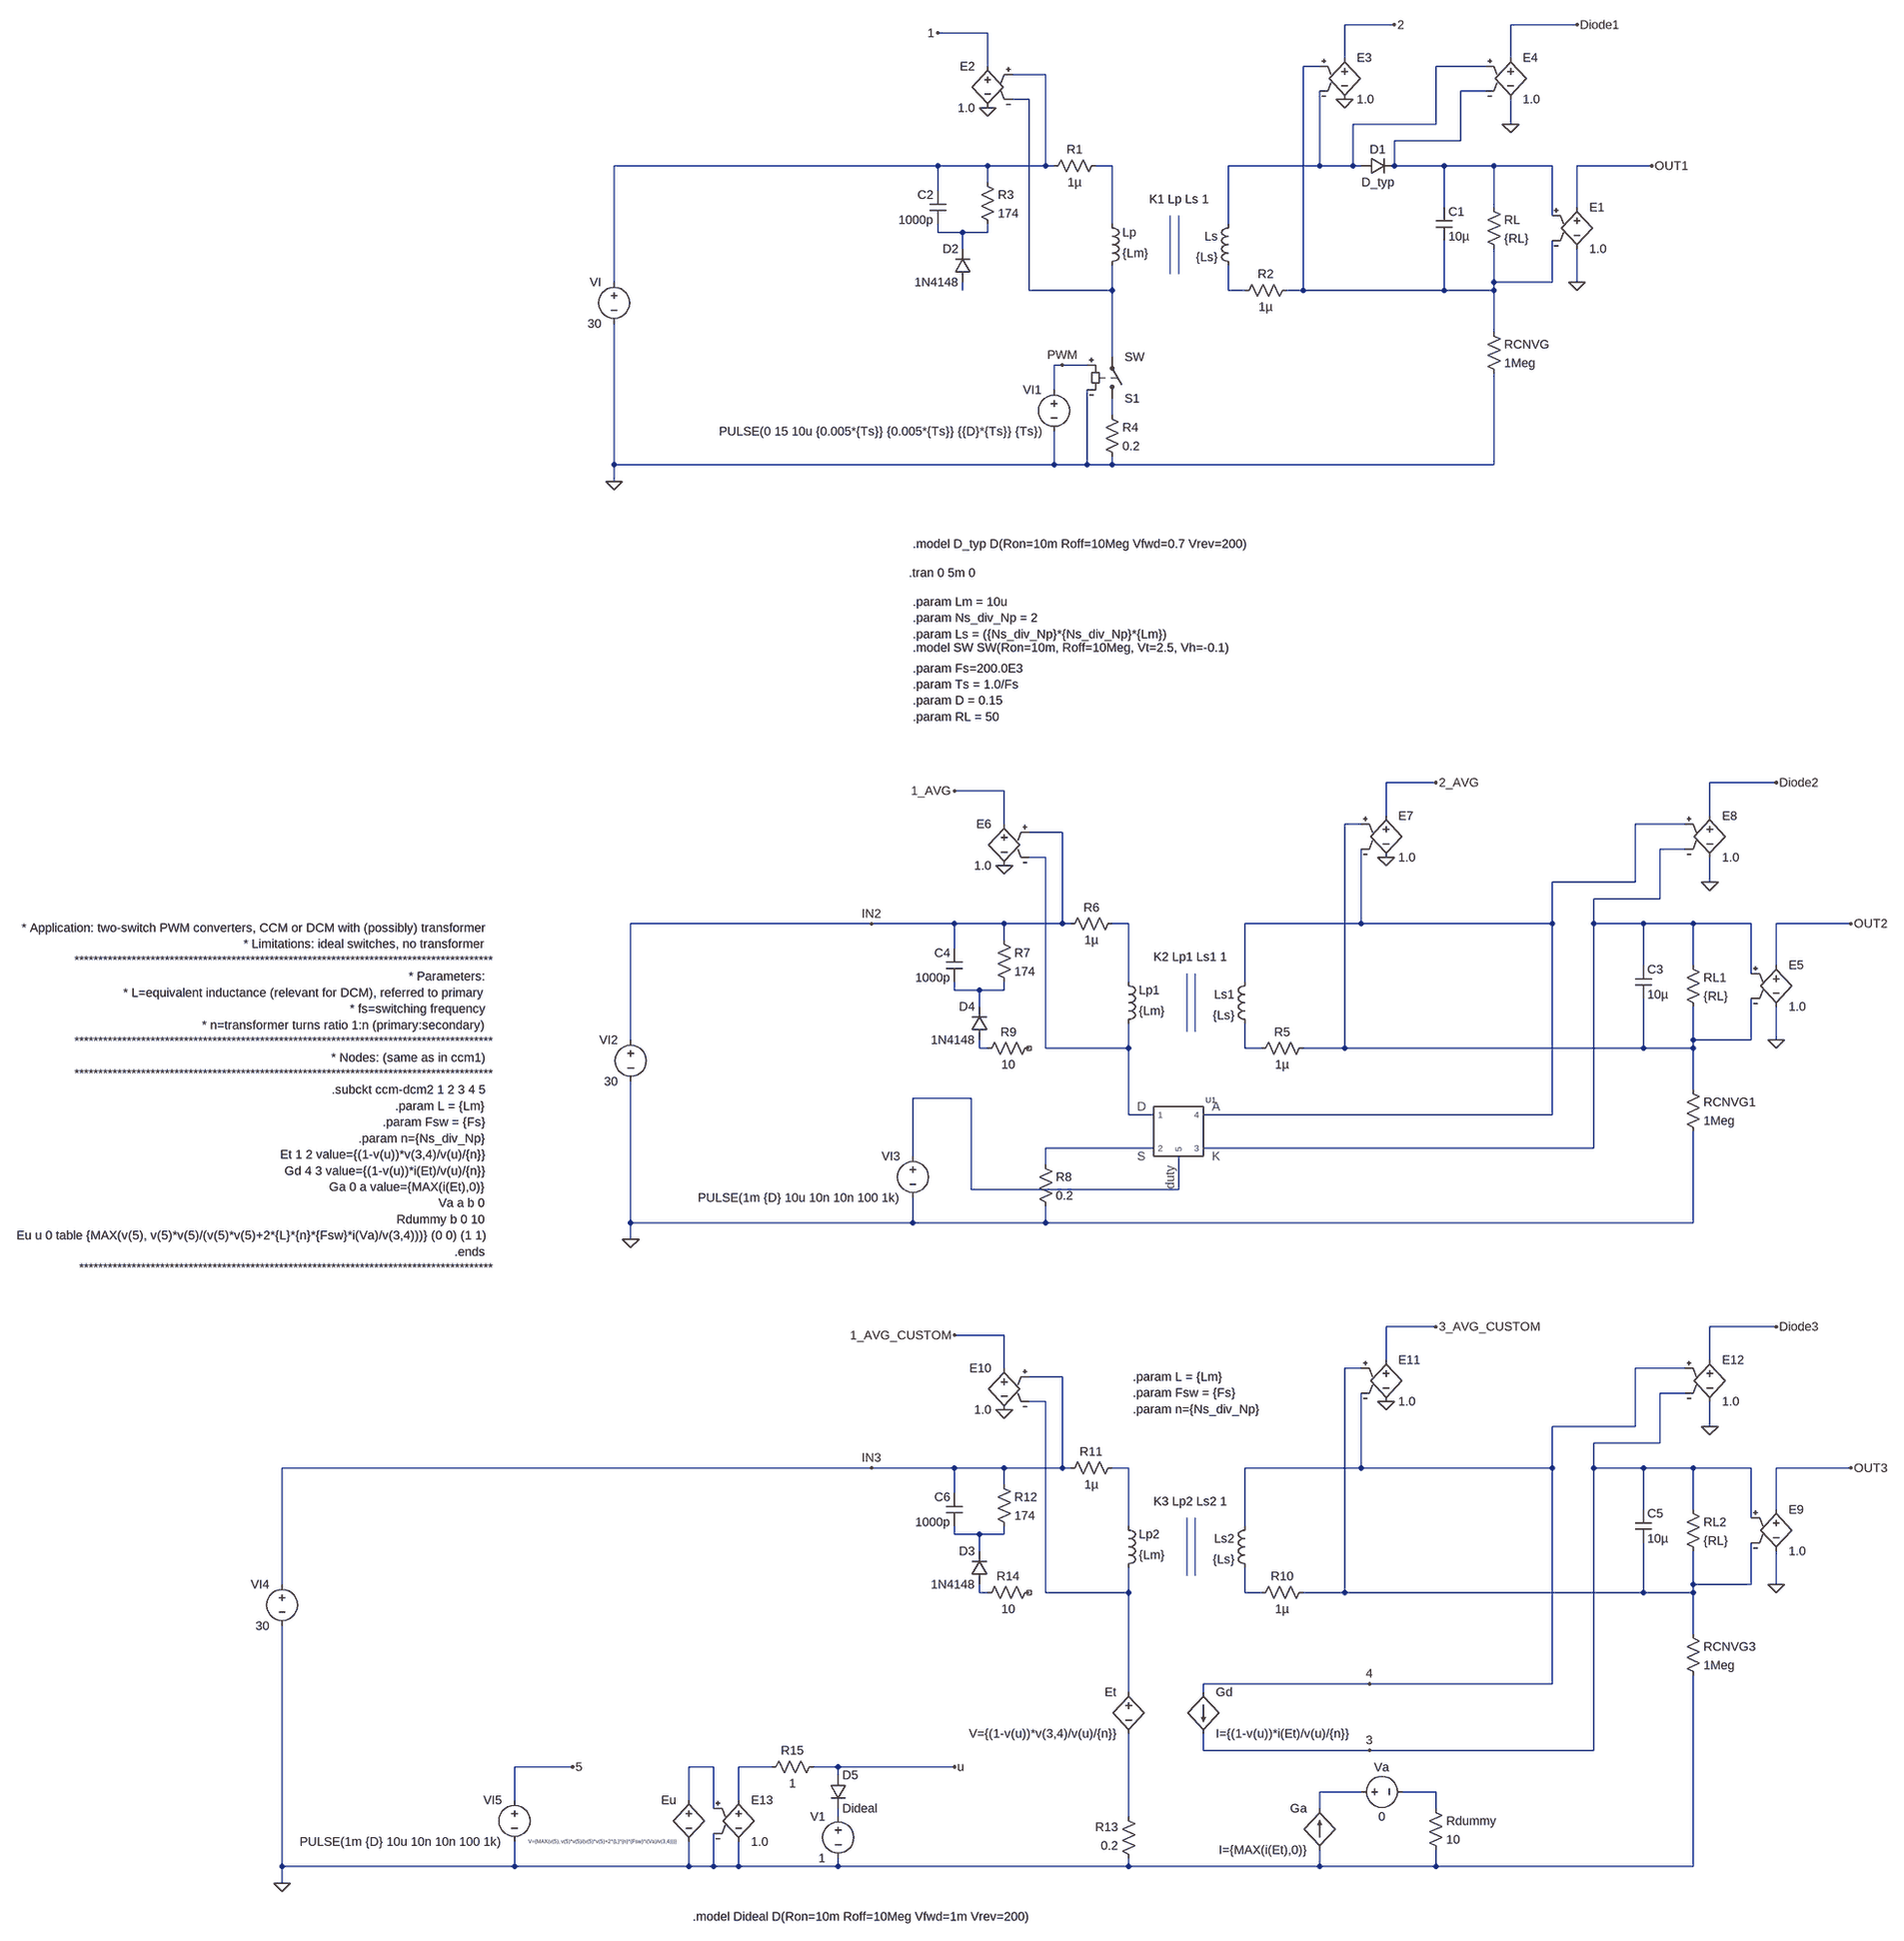
[diagram p0: schematic Flyback_Basic_Model.asc]
Flyback_Basic_Model.asc, the LTspice schematic file:
Version 4.1
SHEET 1 1712 3524
WIRE 624 -288 528 -288
WIRE 976 -288 848 -288
WIRE -160 -272 -256 -272
WIRE 528 -224 528 -288
WIRE 848 -224 848 -288
WIRE -160 -208 -160 -272
WIRE 480 -208 448 -208
WIRE 800 -208 704 -208
WIRE -48 -192 -112 -192
WIRE 800 -160 752 -160
WIRE -80 -144 -112 -144
WIRE 704 -96 704 -208
WIRE 704 -96 544 -96
WIRE 848 -96 848 -144
WIRE 752 -64 752 -160
WIRE 752 -64 624 -64
WIRE -256 -16 -880 -16
WIRE -160 -16 -256 -16
WIRE -48 -16 -48 -192
WIRE -48 -16 -160 -16
WIRE -32 -16 -48 -16
WIRE 80 -16 48 -16
WIRE 480 -16 480 -160
WIRE 480 -16 304 -16
WIRE 544 -16 544 -96
WIRE 544 -16 480 -16
WIRE 560 -16 544 -16
WIRE 624 -16 624 -64
WIRE 720 -16 624 -16
WIRE 816 -16 720 -16
WIRE 928 -16 816 -16
WIRE 1120 -16 976 -16
WIRE -160 16 -160 -16
WIRE -256 32 -256 -16
WIRE 720 64 720 -16
WIRE 816 64 816 -16
WIRE 976 64 976 -16
WIRE 928 80 928 -16
WIRE 80 96 80 -16
WIRE 304 96 304 -16
WIRE -256 112 -256 96
WIRE -208 112 -256 112
WIRE -160 112 -160 96
WIRE -160 112 -208 112
WIRE -208 144 -208 112
WIRE -880 208 -880 -16
WIRE 816 208 816 144
WIRE 928 208 928 128
WIRE 928 208 816 208
WIRE 976 208 976 144
WIRE -208 224 -208 208
WIRE -80 224 -80 -144
WIRE 80 224 80 176
WIRE 80 224 -80 224
WIRE 304 224 304 176
WIRE 336 224 304 224
WIRE 448 224 448 -208
WIRE 448 224 416 224
WIRE 720 224 720 128
WIRE 720 224 448 224
WIRE 816 224 816 208
WIRE 816 224 720 224
WIRE 816 304 816 224
WIRE 80 352 80 224
WIRE -16 368 -32 368
WIRE 32 368 -16 368
WIRE -32 416 -32 368
WIRE 80 464 80 432
WIRE -880 560 -880 288
WIRE -32 560 -32 496
WIRE -32 560 -880 560
WIRE 32 560 32 416
WIRE 32 560 -32 560
WIRE 80 560 80 544
WIRE 80 560 32 560
WIRE 816 560 816 384
WIRE 816 560 80 560
WIRE -880 592 -880 560
WIRE 704 1184 608 1184
WIRE 1360 1184 1232 1184
WIRE -128 1200 -224 1200
WIRE 608 1248 608 1184
WIRE 1232 1248 1232 1184
WIRE -128 1264 -128 1200
WIRE 560 1264 528 1264
WIRE 1184 1264 1088 1264
WIRE -16 1280 -80 1280
WIRE 1184 1312 1136 1312
WIRE -48 1328 -80 1328
WIRE 1088 1376 1088 1264
WIRE 1088 1376 928 1376
WIRE 1232 1376 1232 1328
WIRE 1136 1408 1136 1312
WIRE 1136 1408 1008 1408
WIRE -384 1456 -848 1456
WIRE -224 1456 -384 1456
WIRE -128 1456 -224 1456
WIRE -16 1456 -16 1280
WIRE -16 1456 -128 1456
WIRE 0 1456 -16 1456
WIRE 112 1456 80 1456
WIRE 560 1456 560 1312
WIRE 560 1456 336 1456
WIRE 928 1456 928 1376
WIRE 928 1456 560 1456
WIRE 1008 1456 1008 1408
WIRE 1104 1456 1008 1456
WIRE 1200 1456 1104 1456
WIRE 1312 1456 1200 1456
WIRE 1504 1456 1360 1456
WIRE -128 1488 -128 1456
WIRE -224 1504 -224 1456
WIRE 1104 1536 1104 1456
WIRE 1200 1536 1200 1456
WIRE 1360 1536 1360 1456
WIRE 1312 1552 1312 1456
WIRE 112 1568 112 1456
WIRE 336 1568 336 1456
WIRE -224 1584 -224 1568
WIRE -176 1584 -224 1584
WIRE -128 1584 -128 1568
WIRE -128 1584 -176 1584
WIRE -176 1616 -176 1584
WIRE -848 1680 -848 1456
WIRE 1200 1680 1200 1616
WIRE 1312 1680 1312 1600
WIRE 1312 1680 1200 1680
WIRE 1360 1680 1360 1616
WIRE -176 1696 -176 1680
WIRE -160 1696 -176 1696
WIRE -48 1696 -48 1328
WIRE 112 1696 112 1648
WIRE 112 1696 -48 1696
WIRE 336 1696 336 1648
WIRE 368 1696 336 1696
WIRE 528 1696 528 1264
WIRE 528 1696 448 1696
WIRE 1104 1696 1104 1600
WIRE 1104 1696 528 1696
WIRE 1200 1696 1200 1680
WIRE 1200 1696 1104 1696
WIRE 1200 1776 1200 1696
WIRE -192 1792 -304 1792
WIRE 112 1824 112 1696
WIRE 160 1824 112 1824
WIRE 928 1824 928 1456
WIRE 928 1824 256 1824
WIRE 160 1888 -48 1888
WIRE 1008 1888 1008 1456
WIRE 1008 1888 256 1888
WIRE -304 1904 -304 1792
WIRE -48 1920 -48 1888
WIRE -192 1968 -192 1792
WIRE 208 1968 208 1904
WIRE 208 1968 -192 1968
WIRE -848 2032 -848 1760
WIRE -304 2032 -304 1984
WIRE -304 2032 -848 2032
WIRE -48 2032 -48 2000
WIRE -48 2032 -304 2032
WIRE 1200 2032 1200 1856
WIRE 1200 2032 -48 2032
WIRE -848 2064 -848 2032
WIRE 704 2256 608 2256
WIRE 1360 2256 1232 2256
WIRE -128 2272 -224 2272
WIRE 608 2320 608 2256
WIRE 1232 2320 1232 2256
WIRE -128 2336 -128 2272
WIRE 560 2336 528 2336
WIRE 1184 2336 1088 2336
WIRE -16 2352 -80 2352
WIRE 1184 2384 1136 2384
WIRE -48 2400 -80 2400
WIRE 1088 2448 1088 2336
WIRE 1088 2448 928 2448
WIRE 1232 2448 1232 2400
WIRE 1136 2480 1136 2384
WIRE 1136 2480 1008 2480
WIRE -384 2528 -1520 2528
WIRE -224 2528 -384 2528
WIRE -128 2528 -224 2528
WIRE -16 2528 -16 2352
WIRE -16 2528 -128 2528
WIRE 0 2528 -16 2528
WIRE 112 2528 80 2528
WIRE 560 2528 560 2384
WIRE 560 2528 336 2528
WIRE 928 2528 928 2448
WIRE 928 2528 560 2528
WIRE 1008 2528 1008 2480
WIRE 1104 2528 1008 2528
WIRE 1200 2528 1104 2528
WIRE 1312 2528 1200 2528
WIRE 1504 2528 1360 2528
WIRE -128 2560 -128 2528
WIRE -224 2576 -224 2528
WIRE 1104 2608 1104 2528
WIRE 1200 2608 1200 2528
WIRE 1360 2608 1360 2528
WIRE 1312 2624 1312 2528
WIRE 112 2640 112 2528
WIRE 336 2640 336 2528
WIRE -224 2656 -224 2640
WIRE -176 2656 -224 2656
WIRE -128 2656 -128 2640
WIRE -128 2656 -176 2656
WIRE -176 2688 -176 2656
WIRE -1520 2752 -1520 2528
WIRE 1200 2752 1200 2688
WIRE 1312 2752 1312 2672
WIRE 1312 2752 1200 2752
WIRE 1360 2752 1360 2688
WIRE -176 2768 -176 2752
WIRE -160 2768 -176 2768
WIRE -48 2768 -48 2400
WIRE 112 2768 112 2720
WIRE 112 2768 -48 2768
WIRE 336 2768 336 2720
WIRE 368 2768 336 2768
WIRE 528 2768 528 2336
WIRE 528 2768 448 2768
WIRE 1104 2768 1104 2672
WIRE 1104 2768 528 2768
WIRE 1200 2768 1200 2752
WIRE 1200 2768 1104 2768
WIRE 1200 2848 1200 2768
WIRE 576 2944 256 2944
WIRE 928 2944 928 2528
WIRE 928 2944 576 2944
WIRE 112 2960 112 2768
WIRE 256 2960 256 2944
WIRE 256 3072 256 3040
WIRE 576 3072 256 3072
WIRE 1008 3072 1008 2528
WIRE 1008 3072 576 3072
WIRE -960 3104 -1072 3104
WIRE -688 3104 -736 3104
WIRE -576 3104 -640 3104
WIRE -448 3104 -496 3104
WIRE -224 3104 -448 3104
WIRE -448 3120 -448 3104
WIRE 560 3152 480 3152
WIRE 704 3152 640 3152
WIRE -1072 3168 -1072 3104
WIRE -736 3168 -736 3104
WIRE -640 3168 -640 3104
WIRE -688 3184 -688 3104
WIRE 480 3184 480 3152
WIRE 704 3184 704 3152
WIRE -448 3200 -448 3184
WIRE 112 3200 112 3040
WIRE -1520 3296 -1520 2832
WIRE -1072 3296 -1072 3248
WIRE -1072 3296 -1520 3296
WIRE -736 3296 -736 3248
WIRE -736 3296 -1072 3296
WIRE -688 3296 -688 3232
WIRE -688 3296 -736 3296
WIRE -640 3296 -640 3248
WIRE -640 3296 -688 3296
WIRE -448 3296 -448 3280
WIRE -448 3296 -640 3296
WIRE 112 3296 112 3280
WIRE 112 3296 -448 3296
WIRE 480 3296 480 3264
WIRE 480 3296 112 3296
WIRE 704 3296 704 3264
WIRE 704 3296 480 3296
WIRE 1200 3296 1200 2928
WIRE 1200 3296 704 3296
WIRE -1520 3328 -1520 3296
FLAG -880 592 0
FLAG 976 208 0
FLAG 1120 -16 OUT1
FLAG -160 -128 0
FLAG 528 -144 0
FLAG -256 -272 1
FLAG 624 -288 2
FLAG 848 -96 0
FLAG 976 -288 Diode1
FLAG -848 2064 0
FLAG 1360 1680 0
FLAG 1504 1456 OUT2
FLAG -128 1344 0
FLAG 608 1328 0
FLAG -224 1200 1_AVG
FLAG 704 1184 2_AVG
FLAG -384 1456 IN2
FLAG 1232 1376 0
FLAG 1360 1184 Diode2
FLAG -16 368 PWM
FLAG -1520 3328 0
FLAG 1360 2752 0
FLAG 1504 2528 OUT3
FLAG -128 2416 0
FLAG 608 2400 0
FLAG -224 2272 1_AVG_CUSTOM
FLAG 704 2256 3_AVG_CUSTOM
FLAG -384 2528 IN3
FLAG 1232 2448 0
FLAG 1360 2256 Diode3
FLAG -960 3104 5
FLAG -224 3104 u
FLAG 576 2944 4
FLAG 576 3072 3
SYMBOL ind 64 192 M180
WINDOW 0 36 80 Left 2
WINDOW 3 36 40 Left 2
SYMATTR InstName Lp
SYMATTR Value {Lm}
SYMATTR Type ind
SYMBOL ind 320 80 M0
SYMATTR InstName Ls
SYMATTR Value {Ls}
SYMATTR Type ind
SYMBOL voltage -880 192 M0
WINDOW 123 0 0 Left 0
WINDOW 39 0 0 Left 0
SYMATTR InstName VI
SYMATTR Value 30
SYMBOL voltage -32 400 M0
WINDOW 123 0 0 Left 0
WINDOW 39 0 0 Left 0
SYMATTR InstName VI1
SYMATTR Value PULSE(0 15 10u {0.005*{Ts}} {0.005*{Ts}} {{D}*{Ts}} {Ts})
SYMBOL res 800 48 R0
SYMATTR InstName RL
SYMATTR Value {RL}
SYMBOL cap 704 64 R0
SYMATTR InstName C1
SYMATTR Value 10µ
SYMBOL diode 560 0 R270
WINDOW 0 32 32 VTop 2
WINDOW 3 0 32 VBottom 2
SYMATTR InstName D1
SYMATTR Value D_typ
SYMBOL res 800 288 R0
SYMATTR InstName RCNVG
SYMATTR Value 1Meg
SYMBOL e 976 48 R0
SYMATTR InstName E1
SYMATTR Value 1.0
SYMBOL res 432 208 R90
WINDOW 0 0 56 VBottom 2
WINDOW 3 32 56 VTop 2
SYMATTR InstName R2
SYMATTR Value 1µ
SYMBOL res -48 0 R270
WINDOW 0 32 56 VTop 2
WINDOW 3 0 56 VBottom 2
SYMATTR InstName R1
SYMATTR Value 1µ
SYMBOL e -160 -224 M0
SYMATTR InstName E2
SYMATTR Value 1.0
SYMBOL e 528 -240 R0
SYMATTR InstName E3
SYMATTR Value 1.0
SYMBOL sw 80 448 M180
SYMATTR InstName S1
SYMBOL diode -192 208 R180
WINDOW 0 24 64 Left 2
WINDOW 3 24 0 Left 2
SYMATTR InstName D2
SYMATTR Value 1N4148
SYMBOL cap -240 32 M0
SYMATTR InstName C2
SYMATTR Value 1000p
SYMBOL res -176 0 R0
SYMATTR InstName R3
SYMATTR Value 174
SYMBOL res 64 448 R0
SYMATTR InstName R4
SYMATTR Value 0.2
SYMBOL e 848 -240 R0
SYMATTR InstName E4
SYMATTR Value 1.0
SYMBOL ind 96 1664 M180
WINDOW 0 36 80 Left 2
WINDOW 3 36 40 Left 2
SYMATTR InstName Lp1
SYMATTR Value {Lm}
SYMATTR Type ind
SYMBOL ind 352 1552 M0
SYMATTR InstName Ls1
SYMATTR Value {Ls}
SYMATTR Type ind
SYMBOL voltage -848 1664 M0
WINDOW 123 0 0 Left 0
WINDOW 39 0 0 Left 0
SYMATTR InstName VI2
SYMATTR Value 30
SYMBOL res 1184 1520 R0
SYMATTR InstName RL1
SYMATTR Value {RL}
SYMBOL cap 1088 1536 R0
SYMATTR InstName C3
SYMATTR Value 10µ
SYMBOL res 1184 1760 R0
SYMATTR InstName RCNVG1
SYMATTR Value 1Meg
SYMBOL e 1360 1520 R0
SYMATTR InstName E5
SYMATTR Value 1.0
SYMBOL res 464 1680 R90
WINDOW 0 0 56 VBottom 2
WINDOW 3 32 56 VTop 2
SYMATTR InstName R5
SYMATTR Value 1µ
SYMBOL res -16 1472 R270
WINDOW 0 32 56 VTop 2
WINDOW 3 0 56 VBottom 2
SYMATTR InstName R6
SYMATTR Value 1µ
SYMBOL e -128 1248 M0
SYMATTR InstName E6
SYMATTR Value 1.0
SYMBOL e 608 1232 R0
SYMATTR InstName E7
SYMATTR Value 1.0
SYMBOL diode -160 1680 R180
WINDOW 0 24 64 Left 2
WINDOW 3 24 0 Left 2
SYMATTR InstName D4
SYMATTR Value 1N4148
SYMBOL cap -208 1504 M0
SYMATTR InstName C4
SYMATTR Value 1000p
SYMBOL res -144 1472 R0
SYMATTR InstName R7
SYMATTR Value 174
SYMBOL e 1232 1232 R0
SYMATTR InstName E8
SYMATTR Value 1.0
SYMBOL ccm-dcm2 208 1856 R0
SYMATTR InstName U1
SYMBOL voltage -304 1888 M0
WINDOW 123 0 0 Left 0
WINDOW 39 0 0 Left 0
SYMATTR InstName VI3
SYMATTR Value PULSE(1m {D} 10u 10n 10n 100 1k)
SYMBOL res -64 1904 R0
SYMATTR InstName R8
SYMATTR Value 0.2
SYMBOL res -64 1680 R90
WINDOW 0 0 56 VBottom 2
WINDOW 3 32 56 VTop 2
SYMATTR InstName R9
SYMATTR Value 10
SYMBOL ind 96 2736 M180
WINDOW 0 36 80 Left 2
WINDOW 3 36 40 Left 2
SYMATTR InstName Lp2
SYMATTR Value {Lm}
SYMATTR Type ind
SYMBOL ind 352 2624 M0
SYMATTR InstName Ls2
SYMATTR Value {Ls}
SYMATTR Type ind
SYMBOL voltage -1520 2736 M0
WINDOW 123 0 0 Left 0
WINDOW 39 0 0 Left 0
SYMATTR InstName VI4
SYMATTR Value 30
SYMBOL res 1184 2592 R0
SYMATTR InstName RL2
SYMATTR Value {RL}
SYMBOL cap 1088 2608 R0
SYMATTR InstName C5
SYMATTR Value 10µ
SYMBOL res 1184 2832 R0
SYMATTR InstName RCNVG3
SYMATTR Value 1Meg
SYMBOL e 1360 2592 R0
SYMATTR InstName E9
SYMATTR Value 1.0
SYMBOL res 464 2752 R90
WINDOW 0 0 56 VBottom 2
WINDOW 3 32 56 VTop 2
SYMATTR InstName R10
SYMATTR Value 1µ
SYMBOL res -16 2544 R270
WINDOW 0 32 56 VTop 2
WINDOW 3 0 56 VBottom 2
SYMATTR InstName R11
SYMATTR Value 1µ
SYMBOL e -128 2320 M0
SYMATTR InstName E10
SYMATTR Value 1.0
SYMBOL e 608 2304 R0
SYMATTR InstName E11
SYMATTR Value 1.0
SYMBOL diode -160 2752 R180
WINDOW 0 24 64 Left 2
WINDOW 3 24 0 Left 2
SYMATTR InstName D3
SYMATTR Value 1N4148
SYMBOL cap -208 2576 M0
SYMATTR InstName C6
SYMATTR Value 1000p
SYMBOL res -144 2544 R0
SYMATTR InstName R12
SYMATTR Value 174
SYMBOL e 1232 2304 R0
SYMATTR InstName E12
SYMATTR Value 1.0
SYMBOL voltage -1072 3152 M0
WINDOW 123 0 0 Left 0
WINDOW 39 0 0 Left 0
SYMATTR InstName VI5
SYMATTR Value PULSE(1m {D} 10u 10n 10n 100 1k)
SYMBOL res -64 2752 R90
WINDOW 0 0 56 VBottom 2
WINDOW 3 32 56 VTop 2
SYMATTR InstName R14
SYMATTR Value 10
SYMBOL res 128 3296 R180
WINDOW 0 36 76 Left 2
WINDOW 3 36 40 Left 2
SYMATTR InstName R13
SYMATTR Value 0.2
SYMBOL bv -736 3152 M0
WINDOW 3 24 96 Left 0
SYMATTR InstName Eu
SYMATTR Value V={MAX(v(5), v(5)*v(5)/(v(5)*v(5)+2*{L}*{n}*{Fsw}*i(Va)/v(3,4)))}
SYMBOL bv 112 2944 M0
SYMATTR InstName Et
SYMATTR Value V={(1-v(u))*v(3,4)/v(u)/{n}}
SYMBOL bi 256 2960 R0
SYMATTR InstName Gd
SYMATTR Value I={(1-v(u))*i(Et)/v(u)/{n}}
SYMBOL bi 480 3264 R180
WINDOW 0 24 80 Left 2
WINDOW 3 24 0 Left 2
SYMATTR InstName Ga
SYMATTR Value I={MAX(i(Et),0)}
SYMBOL voltage 544 3152 R270
WINDOW 0 32 56 VTop 2
WINDOW 3 -32 56 VBottom 2
WINDOW 123 0 0 Left 0
WINDOW 39 0 0 Left 0
SYMATTR InstName Va
SYMATTR Value 0
SYMBOL res 688 3168 R0
SYMATTR InstName Rdummy
SYMATTR Value 10
SYMBOL e -640 3152 R0
SYMATTR InstName E13
SYMATTR Value 1.0
SYMBOL res -480 3088 R90
WINDOW 0 0 56 VBottom 2
WINDOW 3 32 56 VTop 2
SYMATTR InstName R15
SYMATTR Value 1
SYMBOL diode -464 3120 R0
SYMATTR InstName D5
SYMATTR Value Dideal
SYMBOL voltage -448 3184 M0
WINDOW 123 0 0 Left 0
WINDOW 39 0 0 Left 0
SYMATTR InstName V1
SYMATTR Value 1
TEXT 152 48 Left 2 !K1 Lp Ls 1
TEXT -312 768 Left 2 !.tran 0 5m 0
TEXT -304 912 Left 2 !.model SW SW(Ron=10m, Roff=10Meg, Vt=2.5, Vh=-0.1)
TEXT -304 952 Left 2 !.param Fs=200.0E3\n.param Ts = 1.0/Fs\n.param D = 0.15\n.param RL = 50
TEXT -304 712 Left 2 !.model D_typ D(Ron=10m Roff=10Meg Vfwd=0.7 Vrev=200)
TEXT -304 824 Left 2 !.param Lm = 10u\n.param Ns_div_Np = 2\n.param Ls = ({Ns_div_Np}*{Ns_div_Np}*{Lm})
TEXT 160 1520 Left 2 !K2 Lp1 Ls1 1
TEXT -1128 1464 Right 2 !* Application: two-switch PWM converters, CCM or DCM with (possibly) transformer\n* Limitations: ideal switches, no transformer\n****************************************************************************************\n* Parameters:\n* L=equivalent inductance (relevant for DCM), referred to primary\n* fs=switching frequency\n* n=transformer turns ratio 1:n (primary:secondary)\n****************************************************************************************\n* Nodes: (same as in ccm1)\n****************************************************************************************\n.subckt ccm-dcm2 1 2 3 4 5\n.param L = {Lm}\n.param Fsw = {Fs}\n.param n={Ns_div_Np}\nEt 1 2 value={(1-v(u))*v(3,4)/v(u)/{n}}\nGd 4 3 value={(1-v(u))*i(Et)/v(u)/{n}}\nGa 0 a value={MAX(i(Et),0)}\nVa a b 0\nRdummy b 0 10\nEu u 0 table {MAX(v(5), v(5)*v(5)/(v(5)*v(5)+2*{L}*{n}*{Fsw}*i(Va)/v(3,4)))} (0 0) (1 1)\n.ends\n***************************************************************************************
TEXT 160 2592 Left 2 !K3 Lp2 Ls2 1
TEXT 120 2352 Left 2 !.param L = {Lm}\n.param Fsw = {Fs}\n.param n={Ns_div_Np}
TEXT -728 3392 Left 2 !.model Dideal D(Ron=10m Roff=10Meg Vfwd=1m Vrev=200)
LINE Normal 192 192 192 80
LINE Normal 208 192 208 80
LINE Normal 224 1664 224 1552
LINE Normal 240 1664 240 1552
LINE Normal 224 2736 224 2624
LINE Normal 240 2736 240 2624

The netlist it stands for:
* Flyback_Basic_Model.asc
Lp N005 N006 {Lm}
Ls N002 N009 {Ls}
VI N003 0 30
VI1 PWM 0 PULSE(0 15 10u {0.005*{Ts}} {0.005*{Ts}} {{D}*{Ts}} {Ts})
RL N004 N001 {RL}
C1 N004 N001 10µ
D1 N002 N004 D_typ
RCNVG N001 0 1Meg
E1 OUT1 0 N004 N001 1.0
R2 N001 N009 1µ
R1 N003 N006 1µ
E2 1 0 N003 N005 1.0
E3 2 0 N001 N002 1.0
S1 N010 N005 PWM 0 SW
D2 N008 N007 1N4148
C2 N003 N007 1000p
R3 N003 N007 174
R4 N010 0 0.2
E4 Diode1 0 N002 N004 1.0
Lp1 N014 N015 {Lm}
Ls1 N012 N018 {Ls}
VI2 IN2 0 30
RL1 N013 N011 {RL}
C3 N013 N011 10µ
RCNVG1 N011 0 1Meg
E5 OUT2 0 N013 N011 1.0
R5 N011 N018 1µ
R6 IN2 N015 1µ
E6 1_AVG 0 IN2 N014 1.0
E7 2_AVG 0 N011 N012 1.0
D4 N017 N016 1N4148
C4 IN2 N016 1000p
R7 IN2 N016 174
E8 Diode2 0 N012 N013 1.0
X§U1 N014 N020 N013 N012 N019 ccm-dcm2  ; pins 1 2 3 4 5
VI3 N019 0 PULSE(1m {D} 10u 10n 10n 100 1k)
R8 N020 0 0.2
R9 NC_01 N017 10
Lp2 N022 N023 {Lm}
Ls2 4 N026 {Ls}
VI4 IN3 0 30
RL2 3 N021 {RL}
C5 3 N021 10µ
RCNVG3 N021 0 1Meg
E9 OUT3 0 3 N021 1.0
R10 N021 N026 1µ
R11 IN3 N023 1µ
E10 1_AVG_CUSTOM 0 IN3 N022 1.0
E11 3_AVG_CUSTOM 0 N021 4 1.0
D3 N025 N024 1N4148
C6 IN3 N024 1000p
R12 IN3 N024 174
E12 Diode3 0 4 3 1.0
VI5 5 0 PULSE(1m {D} 10u 10n 10n 100 1k)
R14 NC_02 N025 10
R13 0 N032 0.2
B§Eu N027 0 V={MAX(v(5), v(5)*v(5)/(v(5)*v(5)+2*{L}*{n}*{Fsw}*i(Va)/v(3,4)))}
B§Et N022 N032 V={(1-v(u))*v(3,4)/v(u)/{n}}
B§Gd 4 3 I={(1-v(u))*i(Et)/v(u)/{n}}
B§Ga 0 N029 I={MAX(i(Et),0)}
Va N029 N030 0
Rdummy N030 0 10
E13 N028 0 N027 0 1.0
R15 u N028 1
D5 u N031 Dideal
V1 N031 0 1
.model D D
.lib standard.dio
K1 Lp Ls 1
.tran 0 5m 0
.model SW SW(Ron=10m, Roff=10Meg, Vt=2.5, Vh=-0.1)
.param Fs=200.0E3
.param Ts = 1.0/Fs
.param D = 0.15
.param RL = 50
.model D_typ D(Ron=10m Roff=10Meg Vfwd=0.7 Vrev=200)
.param Lm = 10u
.param Ns_div_Np = 2
.param Ls = ({Ns_div_Np}*{Ns_div_Np}*{Lm})
K2 Lp1 Ls1 1
* Application: two-switch PWM converters, CCM or DCM with (possibly) transformer
* Limitations: ideal switches, no transformer
****************************************************************************************
* Parameters:
* L=equivalent inductance (relevant for DCM), referred to primary
* fs=switching frequency
* n=transformer turns ratio 1:n (primary:secondary)
****************************************************************************************
* Nodes: (same as in ccm1)
****************************************************************************************
.subckt ccm-dcm2 1 2 3 4 5
.param L = {Lm}
.param Fsw = {Fs}
.param n={Ns_div_Np}
Et 1 2 value={(1-v(u))*v(3,4)/v(u)/{n}}
Gd 4 3 value={(1-v(u))*i(Et)/v(u)/{n}}
Ga 0 a value={MAX(i(Et),0)}
Va a b 0
Rdummy b 0 10
Eu u 0 table {MAX(v(5), v(5)*v(5)/(v(5)*v(5)+2*{L}*{n}*{Fsw}*i(Va)/v(3,4)))} (0 0) (1 1)
.ends
***************************************************************************************
K3 Lp2 Ls2 1
.param L = {Lm}
.param Fsw = {Fs}
.param n={Ns_div_Np}
.model Dideal D(Ron=10m Roff=10Meg Vfwd=1m Vrev=200)
.backanno
.end